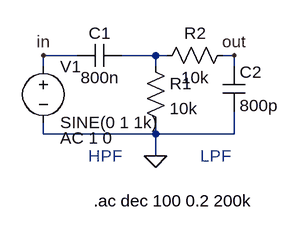
[diagram p0: schematic Band pass filter.asc]
Band pass filter.asc, the LTspice schematic file:
Version 4
SHEET 1 880 680
WIRE 288 240 240 240
WIRE 400 240 352 240
WIRE 416 240 400 240
WIRE 512 240 496 240
WIRE 240 256 240 240
WIRE 400 256 400 240
WIRE 512 256 512 240
WIRE 240 352 240 336
WIRE 400 352 400 336
WIRE 400 352 240 352
WIRE 512 352 512 320
WIRE 512 352 400 352
WIRE 400 384 400 352
FLAG 400 384 0
FLAG 512 240 out
FLAG 240 240 in
SYMBOL voltage 240 240 R0
WINDOW 123 24 118 Left 2
SYMATTR InstName V1
SYMATTR Value SINE(0 1 1k)
SYMATTR Value2 AC 1 0
SYMBOL Res 384 240 R0
SYMATTR InstName R1
SYMATTR Value 10k
SYMBOL Res 512 224 R90
WINDOW 0 0 56 VBottom 2
WINDOW 3 32 56 VTop 2
SYMATTR InstName R2
SYMATTR Value 10k
SYMBOL cap 352 224 R90
WINDOW 0 0 32 VBottom 2
WINDOW 3 32 32 VTop 2
SYMATTR InstName C1
SYMATTR Value 800n
SYMBOL cap 496 256 R0
SYMATTR InstName C2
SYMATTR Value 800p
TEXT 304 384 Left 2 ;HPF
TEXT 464 384 Left 2 ;LPF
TEXT 312 448 Left 2 !.ac dec 100 0.2 200k

The netlist it stands for:
* Band pass filter.asc
V1 in 0 SINE(0 1 1k) AC 1 0
R1 N001 0 10k
R2 out N001 10k
C1 N001 in 800n
C2 out 0 800p
* HPF
* LPF
.ac dec 100 0.2 200k
.backanno
.end